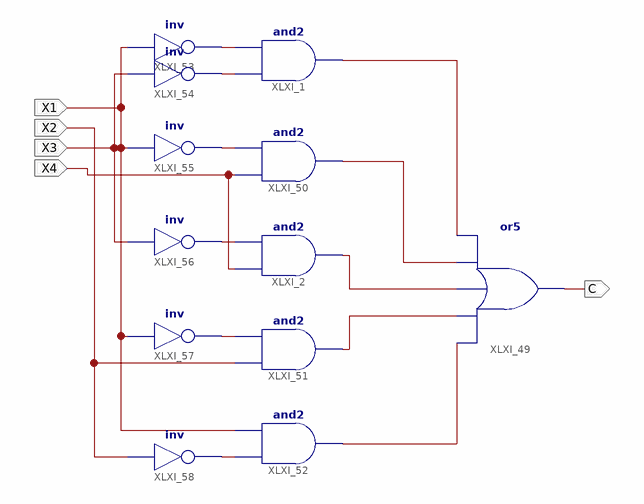
[diagram p0: schematic sheet 1]
// Xilinx ISE schematic bin7seg_c.sch (spartan3e) as structural Verilog: 12 symbols, 5 ports
module bin7seg_c (
  input  X1,
  input  X2,
  input  X3,
  input  X4,
  output C
);

  wire XLXN_4, XLXN_5, XLXN_7, XLXN_9, XLXN_55, XLXN_56, XLXN_57, XLXN_58, XLXN_59, XLXN_60, XLXN_61;

  and XLXI_1 (XLXN_4, XLXN_57, XLXN_56);
  and XLXI_2 (XLXN_7, X4, XLXN_59);
  or XLXI_49 (C, XLXN_55, XLXN_9, XLXN_7, XLXN_5, XLXN_4);
  and XLXI_50 (XLXN_5, X4, XLXN_58);
  and XLXI_51 (XLXN_9, X2, XLXN_60);
  and XLXI_52 (XLXN_55, XLXN_61, X1);
  not XLXI_53 (XLXN_56, X1);
  not XLXI_54 (XLXN_57, X3);
  not XLXI_55 (XLXN_58, X1);
  not XLXI_56 (XLXN_59, X3);
  not XLXI_57 (XLXN_60, X1);
  not XLXI_58 (XLXN_61, X2);
endmodule
